# EAGLE design circle (EAGLE 7.7.0)
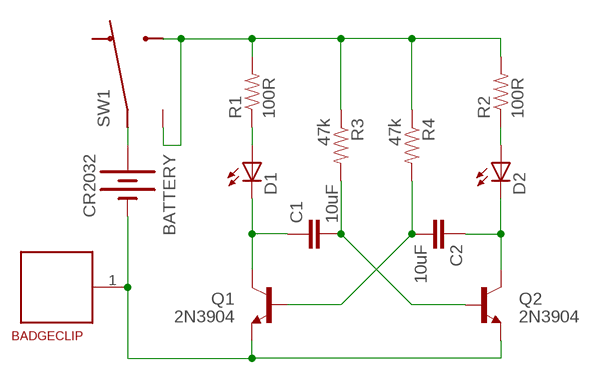
[diagram p0: schematic, sheet 1]

## Parts
BADGECLIP  BADGE_CLIP  [BADGE_CLIP]
BATTERY  CR2032  BATTERY20PTH  [BATTCOM_20MM_PTH]
C1  10uF  C-EU050-024X044  [C050-024X044]
C2  10uF  C-EU050-024X044  [C050-024X044]
D1  LED5MM-KIT  [LED5MM-KIT]
D2  LED5MM-KIT  [LED5MM-KIT]
Q1  2N3904  TRANSISTOR_NPNTO-92-AMMO  [TO-92-AMMO]
Q2  2N3904  TRANSISTOR_NPNTO-92-AMMO  [TO-92-AMMO]
R1  100R  RESISTORPTH-1/4W  [AXIAL-0.4]
R2  100R  RESISTORPTH-1/4W  [AXIAL-0.4]
R3  47k  RESISTORPTH-1/4W  [AXIAL-0.4]
R4  47k  RESISTORPTH-1/4W  [AXIAL-0.4]
SW1  0S102011MS2QN1  [0S102011MS2QN1]

## Nets
CASE2: R1.P$2 R2.P$2 R3.P$1 R4.P$1 SW1.3 SW1.CASE1(CASE2) SW1.CASE2
GND: BADGECLIP.1 BATTERY.2(-) Q1.1(E) Q2.1(E)
N$1: BATTERY.1(+) SW1.2
N$3: C2.1 D2.K(C) Q2.3(C)
N$4: C1.1 D1.K(C) Q1.3(C)
N$6: C2.2 Q1.2(B) R4.P$2
N$7: C1.2 Q2.2(B) R3.P$2
N$8: D2.A R2.P$1
N$10: D1.A R1.P$1

## Power pins joined to a net without a drawn wire
1: SW1.1

## Library data of the parts
BADGECLIP = circle:BADGE_CLIP
BATTERY = circle:BATTERY: Battery Holders Various common sizes : AA, AAA, 20mm coin cell and 12mm coin cell.
C1 C2 = circle:C-EU: CAPACITOR, European symbol
D1 D2 = circle:LED: LEDs Standard schematic elements and footprints for 5mm, 3mm, 1206, and 0603 sized LEDs. 5mm - Spark Fun Electronics SKU : COM-00529 (and others)
Q1 Q2 = circle:TRANSISTOR_NPN: Generic NPN BJT. MMBT2222 is the common NPN we use. Double check against datasheet- not all devices are the same!
R1-R4 = circle:RESISTOR: Resistor Basic schematic elements and footprints for 0603, 1206, and PTH resistors.
SW1 = circle:0S102011MS2QN1

## Board
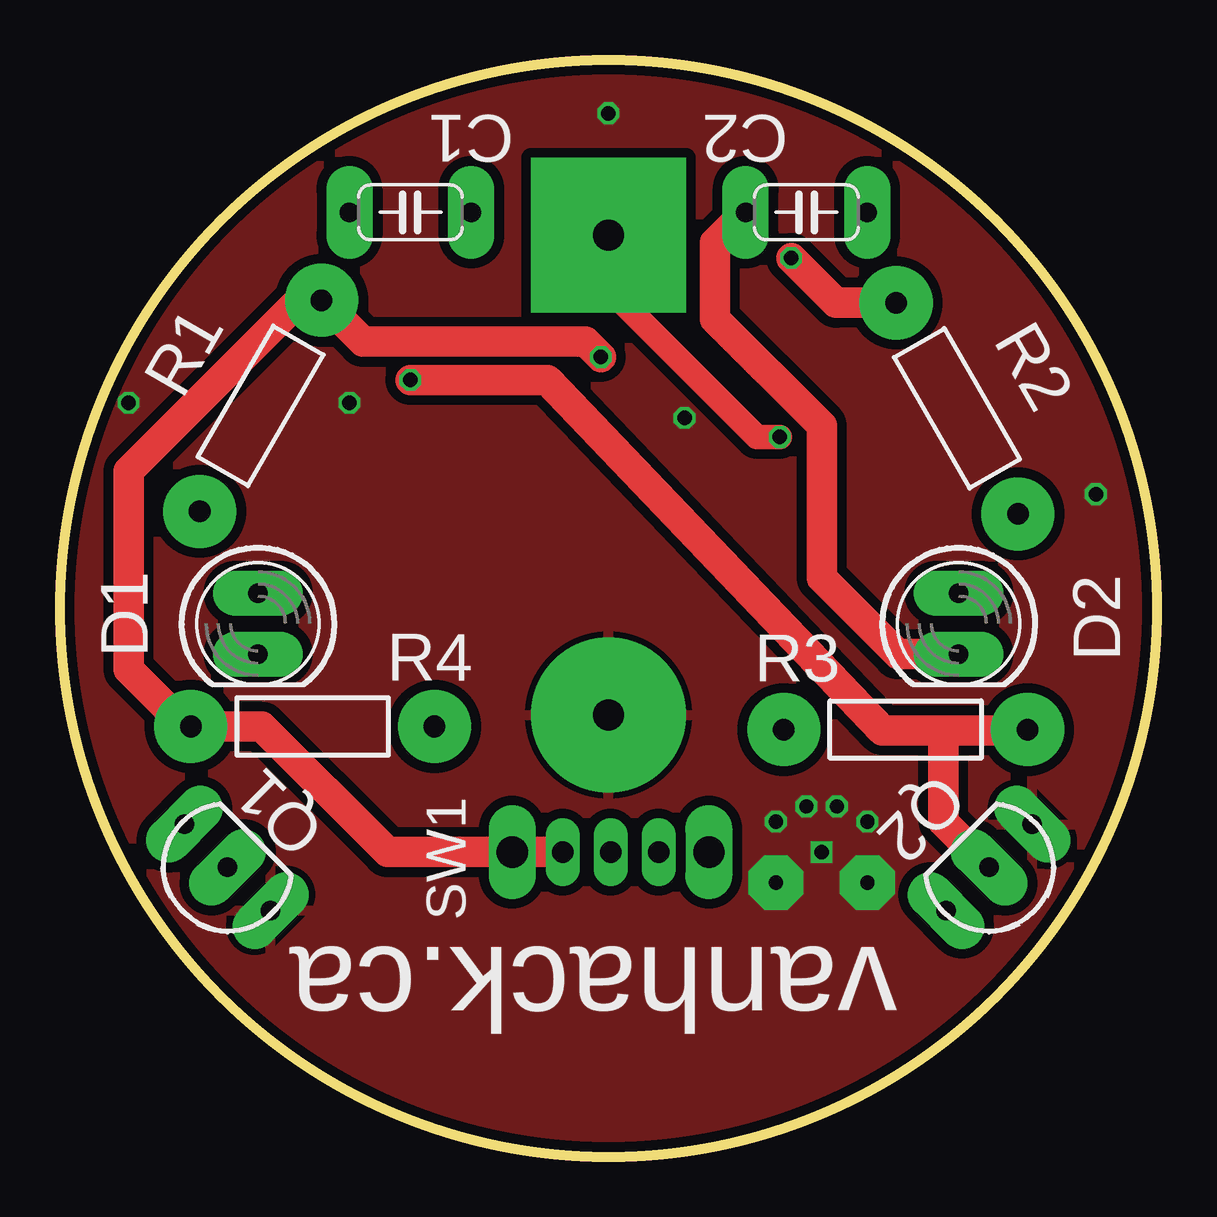
[diagram p1: board, top side]
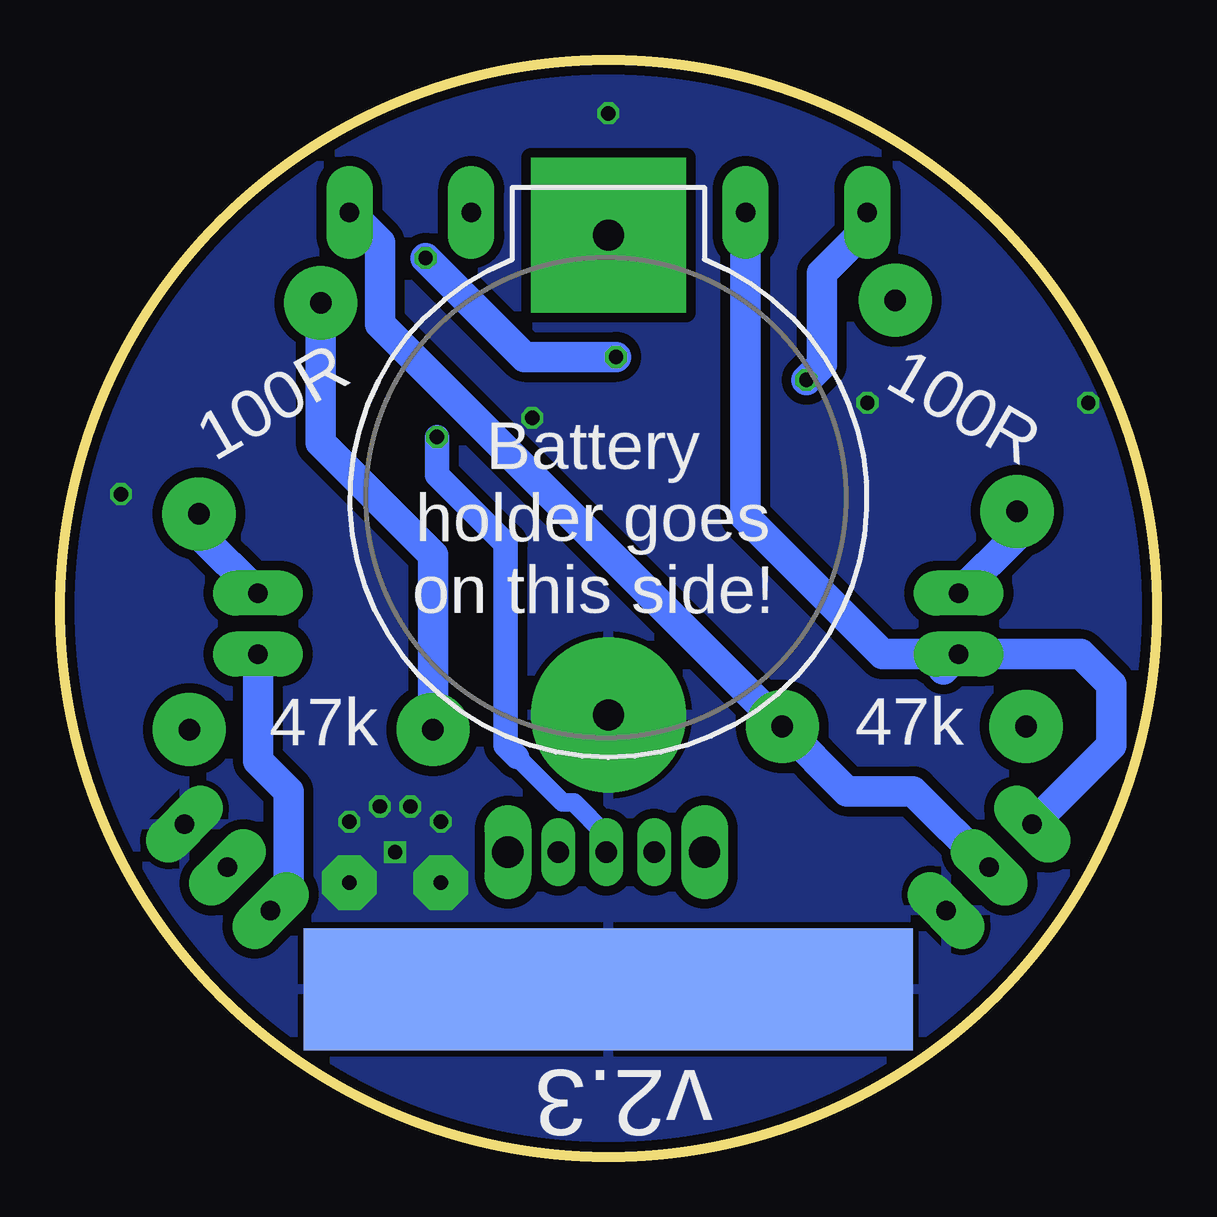
[diagram p2: board, bottom side, seen from below]

Size 45.72 x 45.72 mm. Coordinates in mm from the lower left corner, seen from the top.
Outline: circle at 22.86,22.86 radius 22.86
Copper layers (1*16): Top 0.035mm / dielectric 1.5mm / Bottom 0.035mm
Design rules "iteadstudio_drc": minimum track width 6mil, minimum drill 12mil, track to track 6mil, track to pad 6mil, pad to pad 6mil, via to via 6mil, smd to smd 0mil, copper to edge 10mil, drill to drill 10mil, minimum pad ring 10mil, minimum via ring 6mil, stop-mask expansion 2mil, vias tented up to drill 100mil, thermal gap 10mil

### Footprints (pad centres in the part's own frame; a part is rotated, then mirrored left to right if it is on the bottom)
BADGE_CLIP = smd 25.4 x 5.08: 1 0,0
BATTCOM_20MM_PTH = drill 1.3 pad 6.452 square: 1 20,0 | drill 1.3 pad 6.452: 2 0,0
C050-024X044 = drill 0.813 pad 1.93 long: 1 -2.54,0; 2 2.54,0
LED5MM-KIT = drill 0.813 pad 1.88 long: A -1.27,0; K 1.27,0
TO-92-AMMO = drill 0.813 pad 1.88 long: 1 -2.54,0; 2 0,0; 3 2.54,0
AXIAL-0.4 = drill 0.9 pad 3.048: P$1 -5.08,0; P$2 5.08,0
0S102011MS2QN1 = drill 0.9 long: 1 2.1,0; 2 4.1,0; 3 6.1,0 | drill 1.3 pad 1.778 long: CASE1 0,0; CASE2 8.2,0

### Placement (x,y rotation side)
BADGECLIP  22.86,6.99 0 bottom
BATTERY  22.86,18.42 90 bottom
C1  14.61,39.37 180 top
C2  31.11,39.37 0 top
D1  8.25,22.23 270 top
D2  37.47,22.23 270 top
Q1  6.98,12.07 135 top
Q2  38.73,12.07 225 top
R1  8.36,31.3 60 top
R2  37.39,31.2 120 top
R3  35.25,17.81 0 top
R4  10.53,17.94 0 top
SW1  27.05,12.7 180 top
U$1  [VHS-LOGO-SMALL]  31.75,31.75 180 top

### Tracks (layer width: path | path; a pad name or v marks a point on that pad's centre or on a via)
CASE2  (via drill 0.6)
  Top 1.27: v22.54,33.34 21.91,33.97 12.63,33.97 R1.P$2 9.99,35.7 2.86,28.58 2.86,20.32 5.24,17.94 R4.P$1 8.41,17.94 13.65,12.7 SW1.CASE2 SW1.3 | R2.P$2 32.35,35.6 v30.48,37.47
  Bottom 1.27: R2.P$2 34.85,29.77 30.17,25.09 R3.P$1 | v22.54,33.34 26.35,33.34 v30.48,37.47
GND  (via drill 0.6, 0.6 pad 2.29)
  other vias: 43.18,27.62 29.84,11.43 33.66,11.43 31.75,12.7 29.84,13.97 31.11,14.61 32.38,14.61 33.66,13.97 22.86,43.5 2.86,31.43 12.06,31.43 26.04,30.8
  pour Bottom (isolate 0.406): 22.86,46.36 arc90 -0.64,22.23 arc90 22.22,-0.63 arc90 46.36,22.23 arc90
  pour Top (isolate 0.406): 22.86,46.36 arc90 -0.64,22.86 arc90 22.86,-0.63 arc90 46.36,22.23 arc90
N$1  (via drill 0.6)
  Top 1.016: v30,30 29.05,30 22.86,36.2 BATTERY.1
  Bottom 0.762: 22.95,13.43 24.29,14.76 24.77,14.76 26.67,16.67
  Bottom 1.016: SW1.2 22.95,13.43 | 26.67,16.67 27.15,17.15 27.15,25.56 30,28.42 v30,30
N$3
  Top 1.27: D2.K 34.92,20.96 31.75,24.13 31.75,30.48 27.3,34.93 27.3,38.1 C2.1
  Bottom 1.27: Q2.3 36.19,11.01 36.19,15.24 37.47,16.51 D2.K
N$4
  Bottom 1.27: 8.89,20.32 D1.K | D1.K 11.43,20.96 17.14,26.67 C1.1 | Q1.3 1.9,17.15 1.9,19.69 3.17,20.96 D1.K
N$6
  Bottom 1.27: C2.2 32.38,38.1 32.38,34.71 R4.P$2 12.91,15.24 10.16,15.24 Q1.2
N$7  (via drill 0.6)
  Top 1.27: R3.P$2 39.67,17.78 36.83,17.78 | 36.83,17.78 34.29,17.78 20.32,32.39 v14.61,32.39 | Q2.2 36.83,13.97 36.83,17.78
  Bottom 1.27: v14.61,32.39 13.97,33.02 13.97,36.83 12.06,38.73 C1.2
N$8
  Bottom 1.27: D2.A 39.93,25.96 R2.P$1
N$10
  Bottom 1.27: R1.P$1 5.82,25.93 D1.A

### Text on the board
tNames: vanhack.ca
bNames: Battery / holder goes / on this side! | v2.3